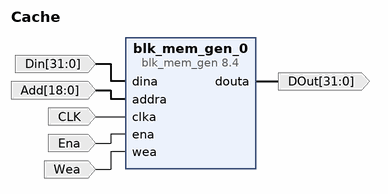
[diagram p0: block diagram of the top level]
# Vivado block design Cache, xcku035-fbva900-1L-i, Vivado 2017.4
create_bd_design Cache

create_bd_port -dir I -from 31 -to 0 -type data Din
create_bd_port -dir I -from 18 -to 0 Add
create_bd_port -dir I -type clk CLK
create_bd_port -dir O -from 31 -to 0 DOut
create_bd_port -dir I Ena
create_bd_port -dir I Wea

create_bd_cell -type ip -vlnv xilinx.com:ip:blk_mem_gen:8.4 blk_mem_gen_0
set_property -dict [list \
  CONFIG.Enable_32bit_Address false \
  CONFIG.Use_Byte_Write_Enable false \
  CONFIG.Write_Depth_A 524288 \
  CONFIG.Register_PortA_Output_of_Memory_Primitives true \
  CONFIG.Use_RSTA_Pin false \
  CONFIG.Disable_Collision_Warnings true \
  CONFIG.use_bram_block Stand_Alone \
] [get_bd_cells blk_mem_gen_0]

# ---- connections ----

connect_bd_net [get_bd_ports Din] [get_bd_pins blk_mem_gen_0/dina]
connect_bd_net [get_bd_ports Add] [get_bd_pins blk_mem_gen_0/addra]
connect_bd_net [get_bd_ports CLK] [get_bd_pins blk_mem_gen_0/clka]
connect_bd_net [get_bd_pins blk_mem_gen_0/douta] [get_bd_ports DOut]
connect_bd_net [get_bd_ports Ena] [get_bd_pins blk_mem_gen_0/ena]
connect_bd_net [get_bd_ports Wea] [get_bd_pins blk_mem_gen_0/wea]

validate_bd_design
save_bd_design
